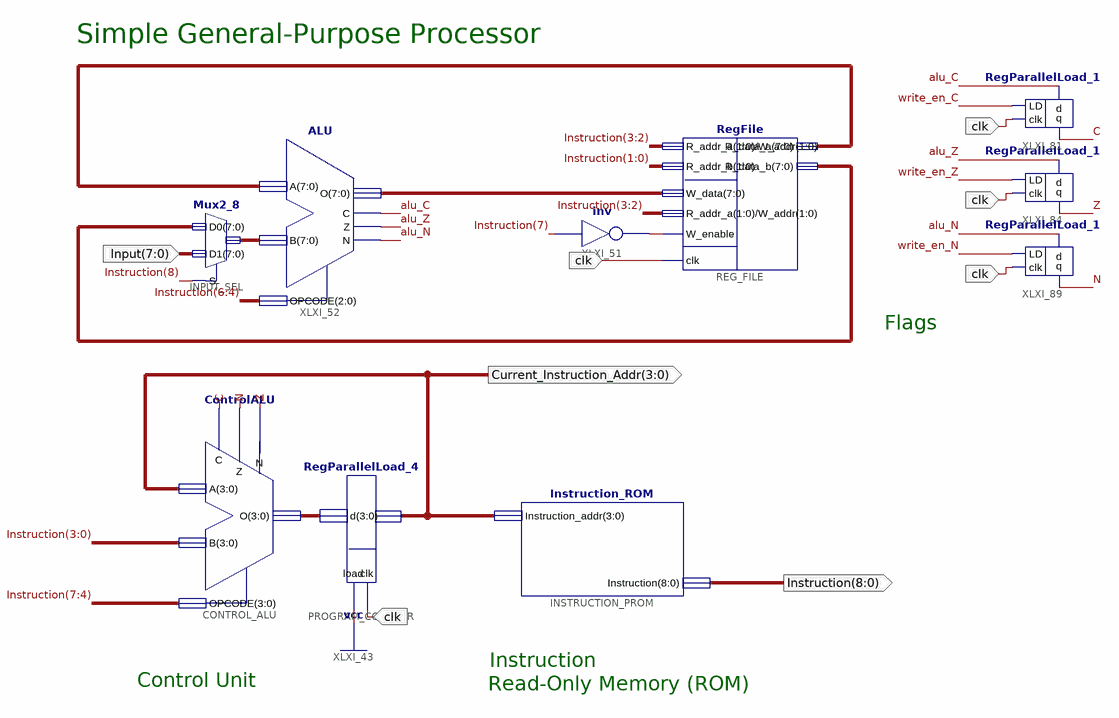
[diagram p0: schematic sheet 1]
// Xilinx ISE schematic MPP_ControlUnit.sch (spartan3e) as structural Verilog: 10 symbols, 4 ports
module MPP_ControlUnit (
  input  clk,
  input  [7:0] Input,
  output [3:0] Current_Instruction_Addr,
  output [8:0] Instruction
);

  wire alu_C, alu_N, alu_Z, C, N, write_en_C, write_en_N, write_en_Z, XLXN_135, Z;
  wire [3:0] PC_NEXT;
  wire [7:0] Output_A, Output_B, XLXN_73, XLXN_156;

  RegParallelLoad_4 PROGRAM_COUNTER (.clk(clk), .q(Current_Instruction_Addr), .load(1'b1), .d(PC_NEXT));
  Instruction_ROM INSTRUCTION_PROM (.Instruction_addr(Current_Instruction_Addr), .Instruction(Instruction));
  Mux2_8 INPUT_SEL (.O(XLXN_73), .D0(Output_B), .D1(Input), .S(Instruction[8]));
  ALU XLXI_52 (.A(Output_A), .B(XLXN_73), .OPCODE(Instruction[6:4]), .C(alu_C), .Z(alu_Z), .N(alu_N), .O(XLXN_156));
  not XLXI_51 (XLXN_135, Instruction[7]);
  RegFile REG_FILE (
    .R_addr_b(Instruction[1:0]), .R_addr_a(Instruction[3:2]), .clk(clk), .W_data(XLXN_156),
    .W_addr(Instruction[3:2]), .W_enable(XLXN_135), .R_data_a(Output_A), .R_data_b(Output_B));
  ControlALU CONTROL_ALU (
    .A(Current_Instruction_Addr), .B(Instruction[3:0]), .O(PC_NEXT), .OPCODE(Instruction[7:4]), .N(Z), .Z(N),
    .C(C));
  RegParallelLoad_1 XLXI_84 (.LD(write_en_Z), .clk(clk), .d(alu_Z), .q(Z));
  RegParallelLoad_1 XLXI_81 (.LD(write_en_C), .clk(clk), .d(alu_C), .q(C));
  RegParallelLoad_1 XLXI_89 (.LD(write_en_N), .clk(clk), .d(alu_N), .q(N));

  // Notes on the sheet:
  //   Simple General-Purpose Processor
  //   Flags
  //   Instruction
  //   Control Unit
  //   Read-Only Memory (ROM)
endmodule
